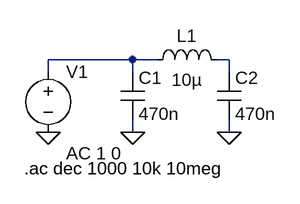
[diagram p0: schematic 200k_RLC_filter.asc]
200k_RLC_filter.asc, the LTspice schematic file:
Version 4
SHEET 1 880 680
WIRE 32 96 -80 96
WIRE 64 96 32 96
WIRE 160 96 144 96
WIRE -80 112 -80 96
WIRE 32 112 32 96
WIRE 160 112 160 96
WIRE 32 192 32 176
WIRE 160 192 160 176
FLAG 32 192 0
FLAG 160 192 0
FLAG -80 192 0
SYMBOL cap 16 112 R0
SYMATTR InstName C1
SYMATTR Value 470n
SYMATTR SpiceLine Rser=500m
SYMBOL ind 48 112 R270
WINDOW 0 32 56 VTop 2
WINDOW 3 5 56 VBottom 2
SYMATTR InstName L1
SYMATTR Value 10µ
SYMATTR SpiceLine Rser=5.0m
SYMBOL cap 144 112 R0
SYMATTR InstName C2
SYMATTR Value 470n
SYMATTR SpiceLine Rser=500m
SYMBOL voltage -80 96 R0
WINDOW 123 24 124 Left 2
WINDOW 39 0 0 Left 0
SYMATTR Value2 AC 1 0
SYMATTR InstName V1
SYMATTR Value ""
TEXT -112 240 Left 2 !.ac dec 1000 10k 10meg

The netlist it stands for:
* 200k_RLC_filter.asc
C1 N001 0 470n Rser=500m
L1 N001 N002 10µ Rser=5.0m
C2 N002 0 470n Rser=500m
V1 N001 0 AC 1 0
.ac dec 1000 10k 10meg
.backanno
.end